# EAGLE design apm2_shield_GPS+MAG+SDF_v141 (EAGLE 5.11)
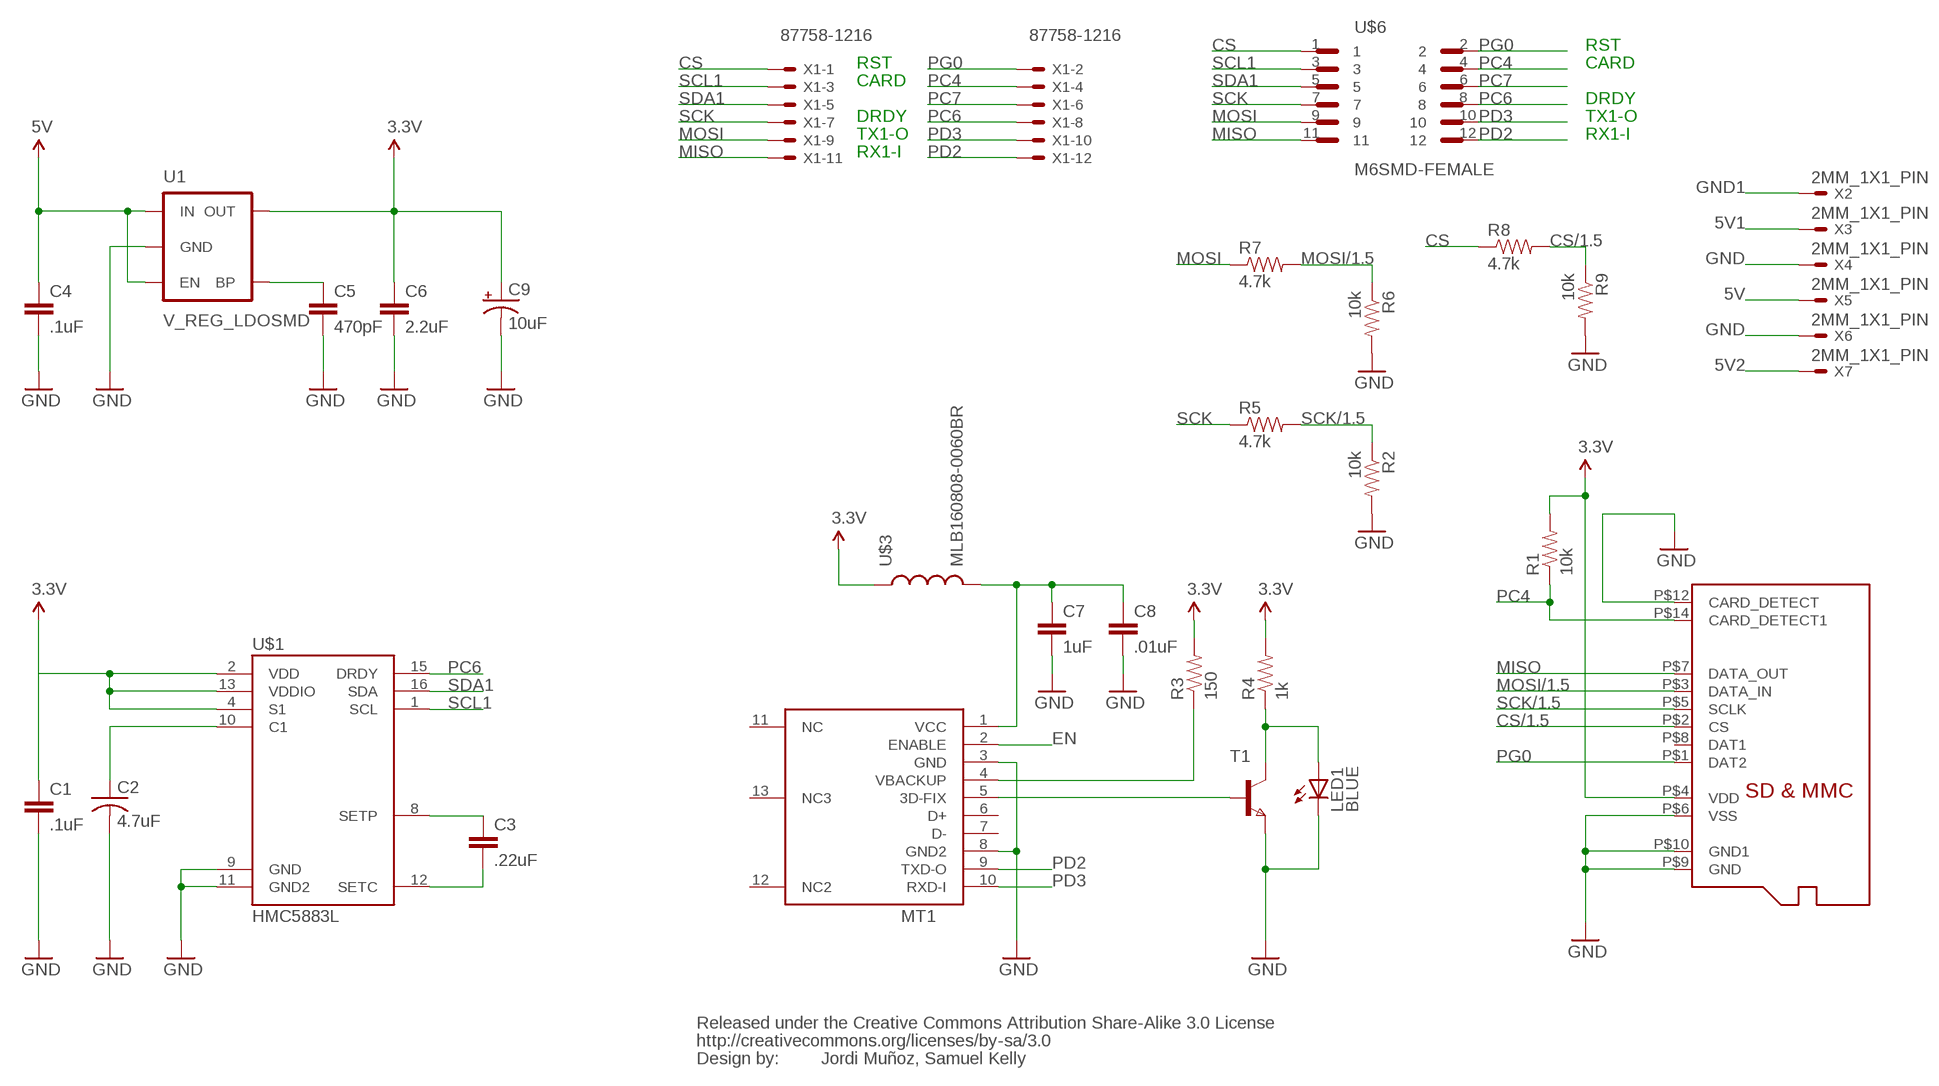
[diagram p0: schematic, sheet 1]

## Parts
C1  .1uF  CAP0402-CAP  [0402-CAP]
C2  4.7uF  C-USC1206  [C1206]
C3  .22uF  CAP0402-CAP  [0402-CAP]
C4  .1uF  CAP0402-CAP  [0402-CAP]
C5  470pF  CAP0402-CAP  [0402-CAP]
C6  2.2uF  CAP0402-CAP  [0402-CAP]
C7  1uF  CAP0402-CAP  [0402-CAP]
C8  .01uF  CAP0402-CAP  [0402-CAP]
C9  10uF  CAP_POL1206  [EIA3216]
LED1  BLUE  LED0603  [LED-0603]
MT1  MEDIATEK_MT3329_ANT_REV  [MEDIATEK_MT3329_ANT_REV]
R1  10k  RESISTOR0402-RES  [0402-RES]
R2  10k  RESISTOR0402-RES  [0402-RES]
R3  150  RESISTOR0402-RES  [0402-RES]
R4  1k  RESISTOR0402-RES  [0402-RES]
R5  4.7k  RESISTOR0402-RES  [0402-RES]
R6  10k  RESISTOR0402-RES  [0402-RES]
R7  4.7k  RESISTOR0402-RES  [0402-RES]
R8  4.7k  RESISTOR0402-RES  [0402-RES]
R9  10k  RESISTOR0402-RES  [0402-RES]
T1  NPNSOT323  [SOT323]
U1  V_REG_LDOSMD  [SOT23-5]
U$1  HMC5883L  [LPCC16]
U$3  MLB160808-0060BR  INDUCTOR0402  [C0402]
U$4  CREATIVE_COMMONS  [CREATIVE_COMMONS]
U$5  MICROSD'NON-PUSH'  [MICROSD_AMPHENOL]
U$6  M6SMD-FEMALE  [M6-2X6-2MM]
X1  87758-1216  [87758-1216]
X2  2MM_1X1_PIN  [2MM_1X1_PIN]
X3  2MM_1X1_PIN  [2MM_1X1_PIN]
X4  2MM_1X1_PIN  [2MM_1X1_PIN]
X5  2MM_1X1_PIN  [2MM_1X1_PIN]
X6  2MM_1X1_PIN  [2MM_1X1_PIN]
X7  2MM_1X1_PIN  [2MM_1X1_PIN]

## Nets
3.3V: C1.1 C6.1 C9.A(+) R1.2 R3.2 R4.2 U1.5(OUT) U$1.2(VDD) U$1.4(S1) U$1.13(VDDIO) U$3.1 U$5.P$4(VDD)
5V: C4.1 U1.1(IN) U1.3(EN) X5.P$1(S)
5V1: X3.P$1(S)
5V2: X7.P$1(S)
CS: R8.1 U$6.1 X1.1
CS/1.5: R8.2 R9.1 U$5.P$2(CS)
EN: MT1.2(ENABLE)
GND: C1.2 C2.2 C4.2 C5.2 C6.2 C7.2 C8.2 C9.C(-) LED1.C MT1.3(GND) MT1.8(GND2) R2.2 R6.2 R9.2 T1.3(E) U1.2(GND) U$1.9(GND) U$1.11(GND2) U$5.P$6(VSS) U$5.P$9(GND) U$5.P$10(GND1) U$5.P$12(CARD_DETECT) X4.P$1(S) X6.P$1(S)
GND1: X2.P$1(S)
MISO: U$5.P$7(DATA_OUT) U$6.11 X1.11
MOSI: R7.1 U$6.9 X1.9
MOSI/1.5: R6.1 R7.2 U$5.P$3(DATA_IN)
N$1: C2.1 U$1.10(C1)
N$2: C3.1 U$1.8(SETP)
N$3: C3.2 U$1.12(SETC)
N$4: C7.1 C8.1 MT1.1(VCC) U$3.2
N$5: C5.1 U1.4(BP)
N$6: MT1.4(VBACKUP) R3.1
N$7: LED1.A R4.1 T1.1(C)
N$8: MT1.5(3D-FIX) T1.2(B)
PC4: R1.1 U$5.P$14(CARD_DETECT1) U$6.4 X1.4
PC6: U$1.15(DRDY) U$6.8 X1.8
PC7: U$6.6 X1.6
PD2: MT1.9(TXD-O) U$6.12 X1.12
PD3: MT1.10(RXD-I) U$6.10 X1.10
PG0: U$5.P$1(DAT2) U$6.2 X1.2
SCK: R5.1 U$6.7 X1.7
SCK/1.5: R2.1 R5.2 U$5.P$5(SCLK)
SCL1: U$1.1(SCL) U$6.3 X1.3
SDA1: U$1.16(SDA) U$6.5 X1.5
Unconnected: MT1.6(D+) MT1.7(D-) MT1.11(NC) MT1.12(NC2) MT1.13(NC3) U$5.P$8(DAT1)

## Notes on the sheet
- RST
- RST | CARD
- CARD
- DRDY
- DRDY | TX1-O
- TX1-O | RX1-I
- RX1-I
- Jordi Muñoz, Samuel Kelly

## Library data of the parts
C1 C3-C8 = SparkFun:CAP: Capacitor Standard 0603 ceramic capacitor, and 0.1" leaded capacitor.
C2 = rcl:C-US: CAPACITOR, American symbol
C9 = SparkFun:CAP_POL: Capacitor Polarized These are standard SMD and PTH capacitors. Normally 10uF, 47uF, and 100uF in electrolytic and tantalum varieties. Always verify the external diameter of the through hole cap, it varies with capacity, voltage, and manufacturer. The EIA devices should be standard.
LED1 = SparkFun:LED: LEDs Standard schematic elements and footprints for 5mm, 3mm, 1206, and 0603 sized LEDs. 5mm - Spark Fun Electronics SKU : COM-00529 (and others)
MT1 = 3DRobotics:MEDIATEK_MT3329_ANT_REV: Based on MediaTek Single Chip Architecture. Dimension?16mm x 16mm x 6mm. L1 Frequency, C/A code, 66 channels. High Sensitivity?Up to -165dBm tracking, superior urban performances.
R1-R9 = SparkFun:RESISTOR: Resistor Basic schematic elements and footprints for 0603, 1206, and PTH 1/10th watt (small) resistors.
T1 = 3DRobotics:NPNSOT323: NPN TRANSISTOR; DATASHEET: http://www.nxp.com/documents/data_sheet/PDTC143E_SERIES.pdf; LINK: http://www.mouser.com/Search/ProductDetail.aspx?qs=LOCUfHb8d9uiSUZNrng0PQ%3D%3D; MFGPN: PDTC143EU,115
U1 = SparkFun:V_REG_LDO: Voltage Regulator LDO Standard 150mA LDO voltage regulator in SOT-23 layout. Micrel part MIC5205. BP (by-pass) pin is used to lower output noise with 470pF cap.
U$1 = 3DRobotics:HMC5883L: Honeywell HMC5883L 3-axis digital compass IC Successor to the HMC5843.; DATASHEET: http://www.dsscircuits.com/images/datasheets/HMC5883L.pdf; LINK: http://parts.digikey.com/1/parts/2057013-ic-compass-3-axis-i2c-16lcc-smd-hmc5883l-tr.html; MFGPN: HMC5883L-TR
U$3 = SparkFun:INDUCTOR: Inductors Basic Inductor/Choke - 0603 and 1206. Footprints are not proven and vary greatly between part numbers.
U$4 = SparkFun:CREATIVE_COMMONS
U$5 = 3DRobotics:MICROSD: Micro-SD / Transflash card holder with SPI pinout For the 3M # 2908-05WB-MG and/or 4UCON #19656 push-push type
U$6 = 3DRobotics:M6
X1 = con-molex:87758-1216: 12 Pin - 2mm Dual Row Single Wafer, Vertical T/H HDR Source: http://www.molex.com/pdm_docs/sd/877580616_sd.pdf; MPN: 87758-1216; OC_FARNELL: unknown; OC_NEWARK: 25M5671
X2-X7 = 3DRobotics:2MM_1X1_PIN: 2 Pin - 2mm Dual Row Single Wafer, Vertical T/H HDR Source: http://www.molex.com/pdm_docs/sd/877580616_sd.pdf

## Board
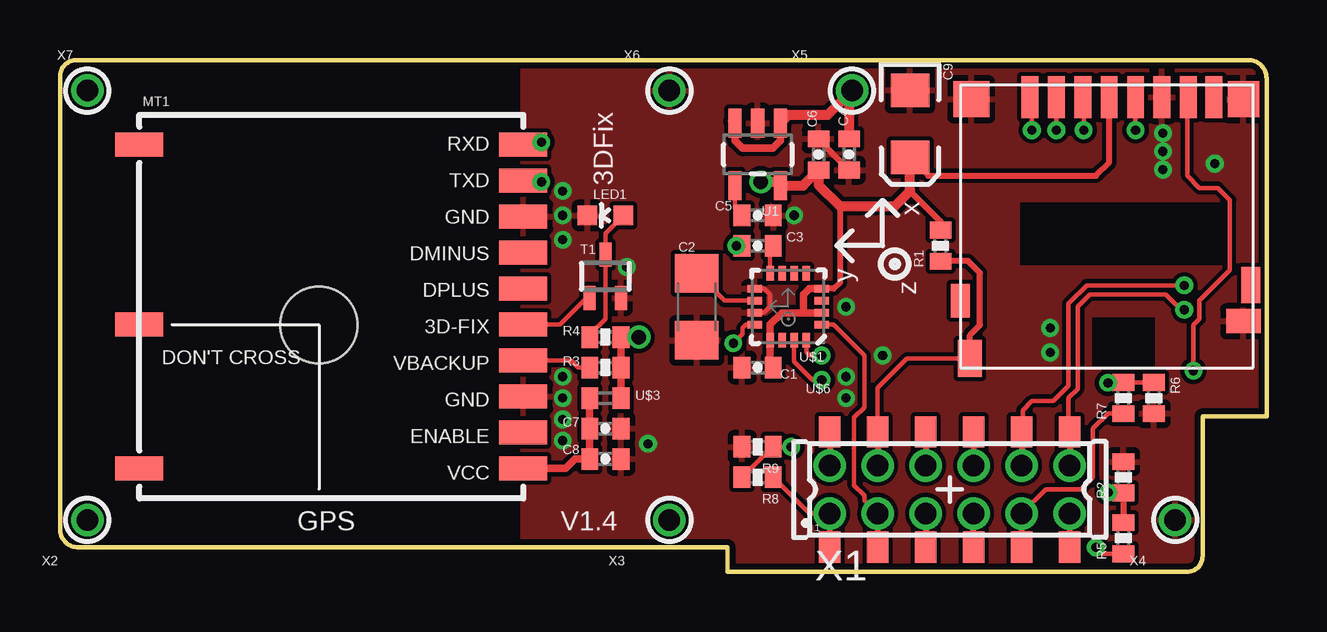
[diagram p1: board, top side]
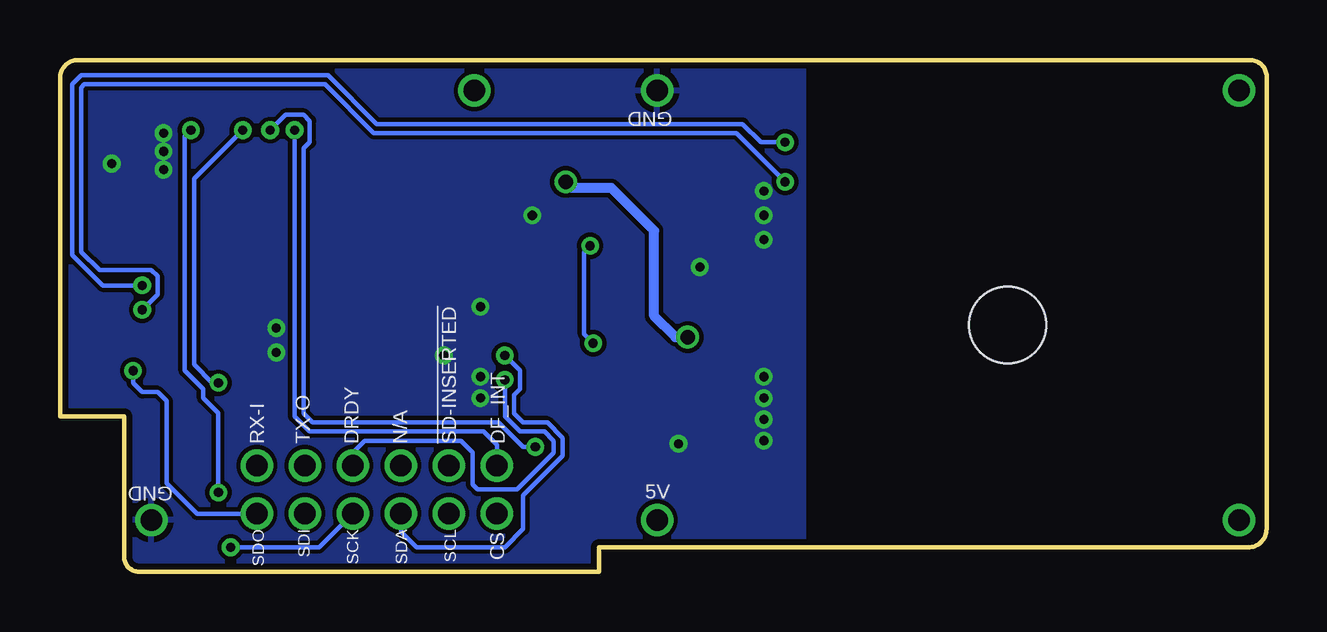
[diagram p2: board, bottom side, seen from below]

Size 50.29 x 21.34 mm. Coordinates in mm from the lower left corner, seen from the top.
Outline: 47.62,0.64 arc-90 46.99,0 27.81,0 27.81,1.02 0.76,1.02 arc-90 0,1.78 0,20.7 arc-90 0.76,21.34 49.53,21.34 arc-90 50.29,20.57 50.29,6.48 47.62,6.48 47.62,0.64
Copper layers (1*2+15*16): Top 0.035mm / dielectric 1.5mm / Route2 0.035mm / dielectric 0.15mm / Route15 0.035mm / dielectric 0.2mm / Bottom 0.035mm
Design rules "3DRobotics_4layers": minimum track width 7mil, minimum drill 15mil, track to track 7mil, track to pad 7mil, pad to pad 7mil, via to via 7mil, smd to smd 0mil, copper to edge 10mil, drill to drill 8mil, minimum pad ring 7mil, minimum via ring 7mil, stop-mask expansion 4mil, vias tented up to drill 25mil, thermal gap 10mil
Holes 3.2 mm at 10.79,10.29

### Footprints (pad centres in the part's own frame; a part is rotated, then mirrored left to right if it is on the bottom)
0402-CAP = smd 0.7 x 0.9: 1 -0.65,0; 2 0.65,0
C1206 = smd 1.6 x 1.8: 1 -1.4,0; 2 1.4,0
EIA3216 = smd 1.4 x 1.6: A 1.4,0; C -1.4,0
LED-0603 = smd 0.8 x 0.8: A 0,-0.75; C 0,0.75
MEDIATEK_MT3329_ANT_REV = smd 2 x 1: 1 -8,6.75; 2 -8,5.25; 3 -8,3.75; 4 -8,2.25; 5 -8,0.75; 6 -8,-0.75; 7 -8,-2.25; 8 -8,-3.75; 9 -8,-5.25; 10 -8,-6.75; 11 8,6.75; 12 8,-6.75; 13 8,0.75
0402-RES = smd 0.7 x 0.9: 1 -0.65,0; 2 0.65,0
SOT323 = smd 0.5 x 1: 1 0,0.9; 2 -0.65,-0.9; 3 0.65,-0.9
SOT23-5 = smd 0.55 x 1.2: 1 -0.95,-1.3; 2 0,-1.3; 3 0.95,-1.3; 4 0.95,1.3; 5 -0.95,1.3
LPCC16 = smd 0.6 x 0.3: 1 -1.4,0.75; 2 -1.4,0.25; 3 -1.4,-0.25; 4 -1.4,-0.75; 9 1.4,-0.75; 10 1.4,-0.25; 11 1.4,0.25; 12 1.4,0.75 | smd 0.3 x 0.6: 5 -0.75,-1.4; 6 -0.25,-1.4; 7 0.25,-1.4; 8 0.75,-1.4; 13 0.75,1.4; 14 0.25,1.4; 15 -0.25,1.4; 16 -0.75,1.4
C0402 = smd 0.7 x 0.9: 1 -0.65,0; 2 0.65,0
MICROSD_AMPHENOL = smd 0.7 x 1.75: P$1 7.7,-1; P$2 6.6,-1; P$3 5.5,-1; P$4 4.4,-1; P$5 3.3,-1; P$6 2.2,-1; P$7 1.1,-1; P$8 0.04,-1 | smd 1.5 x 1.5: P$9 10.15,-0.9 | smd 1.3 x 1.5: P$10 -1.2,-0.9 | smd 0.8 x 1.5: P$11 -1.5,6.85 | smd 1.45 x 1: P$12 -1.2,8.35 | smd 0.8 x 1.4: P$13 10.6,7.5 | smd 1 x 1.55: P$14 10.2,9.9
M6-2X6-2MM = smd 0.89 x 1.3: 1 -5,-2.4; 2 -5,2.4; 3 -3,-2.4; 4 -3,2.4; 5 -1,-2.4; 6 -1,2.4; 7 1,-2.4; 8 1,2.4; 9 3,-2.4; 10 3,2.4; 11 5,-2.4; 12 5,2.4
87758-1216 = drill 0.9 pad 1.27 round: 1 -5,-1; 2 -5,1; 3 -3,-1; 4 -3,1; 5 -1,-1; 6 -1,1; 7 1,-1; 8 1,1; 9 3,-1; 10 3,1; 11 5,-1; 12 5,1
2MM_1X1_PIN = drill 0.9 pad 1.27 round: P$1 0,0

### Placement (x,y rotation side)
C1  29.08,8.51 180 top
C2  26.54,11.05 270 top
C3  29.08,13.59 180 top
C4  32.89,17.4 270 top
C5  29.08,14.86 0 top
C6  31.62,17.4 90 top
C7  22.73,5.97 0 top
C8  22.73,4.7 0 top
C9  35.43,18.67 270 top
LED1  22.73,14.86 90 top
MT1  11.3,11.05 180 top
R1  36.7,13.59 90 top
R2  44.32,3.94 90 top
R3  22.73,8.51 0 top
R4  22.73,9.78 0 top
R5  44.32,1.4 90 top
R6  45.59,7.24 270 top
R7  44.32,7.24 90 top
R8  29.08,3.94 180 top
R9  29.08,5.21 180 top
T1  22.73,12.32 0 top
U1  29.08,17.4 180 top
U$1  30.35,11.05 180 top
U$3  22.73,7.24 180 top
U$4  19.69,-10.54 0 top  (outside the outline)
U$5  48.13,18.8 180 top
U$6  37.08,3.43 0 top
X1  37.08,3.43 0 top
X2  1.14,2.16 0 top
X3  25.4,2.16 0 top
X4  46.48,2.16 0 top
X5  33.02,20.07 0 top
X6  25.4,20.07 0 top
X7  1.14,20.07 0 top

### Tracks (layer width: path | path; a pad name or v marks a point on that pad's centre or on a via)
3.3V  (via drill 0.6)
  Top 0.178: 29.72,8.51 C1.1
  Top 0.254: U$5.P$4 43.73,17.06 43.18,16.51 36.19,16.51 C9.A | U$1.4 32.25,11.8 32.51,12.06 32.51,15.24 | R1.2 36.7,14.6 35.43,15.88
  Top 0.305: U$3.1 R3.2 R4.2 | 30.99,10.79 30.1,10.79 29.6,10.3 U$1.13 29.6,8.62 29.72,8.51 | 30.99,10.79 U$1.2 | U$1.4 31.23,11.8 30.99,11.56 30.99,10.79 | 31.62,16.76 31.61,16.76 C6.1
  Top 0.406: C9.A 35.43,15.88 34.8,15.24 32.51,15.24 31.62,16.13 C6.1 30.97,16.1 U1.5 29.88,16.26 v29.21,16.26 | R4.2 v24.13,9.78
  Bottom 0.406: v24.13,9.78 24.64,9.78 25.53,10.67 25.53,14.22 27.3,16 28.96,16 v29.21,16.26
5V
  Top 0.305: U1.3 28.13,17.97 28.45,17.65 29.72,17.65 30.03,17.97 U1.1
  Top 0.406: U1.3 28.04,18.8 | 32.89,18.41 C4.1 32.89,19.94 X5.P$1 32,19.05 30.38,19.05 U1.1
CS
  Top 0.178: X1.1 31.24,2.43 R8.1
  Top 0.254: U$6.1 X1.1
CS/1.5  (via drill 0.38)
  Top 0.178: U$5.P$2 v41.53,18.42 v41.53,18.41 | v30.48,5.21 R9.1 29.7,5.21 R8.2
  Bottom 0.178: v41.53,18.41 40.89,19.05 40.13,19.05 39.88,18.8 39.88,17.91 40.13,17.65 40.13,6.6 39.75,6.22 32,6.22 30.99,5.21 v30.48,5.21
GND  (via drill 0.38)
  Top 0.178: U$1.9 29.35,11.8 29.59,11.56 29.59,11.05 29.34,10.8 U$1.11
  Top 0.203: C4.2 32.89,16.78
  Top 0.254: C6.2 31.62,18.02 C4.2
  other vias: 20.96,7.24 20.96,14.86 20.96,13.84 20.96,15.88 48.13,17.02 45.97,16.76 41.27,10.16 24.51,5.33 20.96,8.13 20.96,6.35 30.61,14.86 23.62,12.7 41.27,9.14 20.96,5.46 32.77,7.24 32.77,8.13 45.97,18.29 45.97,17.53 32.77,11.05 34.29,9.02
  pour Bottom: 19.3,0.89 19.3,23.75 50.67,23.75 50.67,-2.92 27.81,-2.92 27.81,0.89
  pour Top: 19.3,0.89 19.3,23.75 50.67,23.75 50.67,-2.92 27.81,-2.92 27.81,0.89
MISO  (via drill 0.38)
  Top 0.178: U$5.P$7 46.99,19.75 46.99,16.51 47.5,16 48.26,16 48.77,15.49 48.77,12.57 47.5,11.3 47.5,10.54 47.24,10.29 v47.24,8.38
  Top 0.254: U$6.11 X1.11
  Bottom 0.178: v47.24,8.38 47.24,7.87 46.86,7.49 46.23,7.49 45.85,7.11 45.85,3.68 44.58,2.41 42.1,2.41 X1.11
MOSI
  Top 0.178: X1.9 41.08,3.43 42.54,3.43 43.05,3.94 43.05,5.97 43.69,6.6 44.31,6.6 R7.1
  Top 0.254: U$6.9 X1.9
MOSI/1.5  (via drill 0.38)
  Top 0.178: v42.67,18.41 42.67,19.76 U$5.P$3 | R6.1 R7.2 43.7,7.89 v43.69,7.87
  Bottom 0.178: v42.67,18.41 44.7,16.38 44.7,8.64 43.94,7.87 v43.69,7.87
N$1
  Top 0.178: U$1.10 27.69,11.3 C2.1
N$2
  Top 0.178: C3.1 29.73,13.48 29.59,13.33 29.59,12.46 U$1.8
N$3  (via drill 0.38)
  Top 0.178: v28.19,13.59 C3.2 | U$1.12 28.59,10.3 28.45,10.16 28.45,9.91 v28.07,9.52
  Bottom 0.178: v28.19,13.59 28.45,13.33 28.45,9.91 v28.07,9.52
N$4
  Top 0.305: U$3.2 C7.1 C8.1 21.46,4.7 21.06,4.3 MT1.1
N$5
  Top 0.178: U1.4 28.13,15.16 C5.1
N$6
  Top 0.178: MT1.4 21.3,8.8 21.59,8.51 R3.1
N$7
  Top 0.178: R4.1 22.08,9.89 22.73,10.54 T1.1 22.73,14.11 LED1.A
N$8
  Top 0.178: MT1.5 20.84,10.3 21.97,11.43 22.07,11.43 T1.2
PC4
  Top 0.178: U$5.P$14 35.31,8.89 34.08,7.67 U$6.4
  Top 0.254: U$5.P$14 37.93,9.87 38.35,10.29 38.35,12.45 37.85,12.95 36.72,12.95 R1.1 | U$6.4 X1.4
PC6  (via drill 0.38)
  Top 0.178: U$1.15 30.6,8.77 31.37,8 v31.75,8
  Top 0.254: U$6.8 X1.8
  Bottom 0.178: X1.8 38.08,4.97 37.59,5.46 33.58,5.46 33.1,4.98 33.1,3.63 32.89,3.43 31.24,3.43 29.72,4.95 29.72,5.46 30.1,5.84 31.12,5.84 31.75,6.48 v31.75,8
PC7
  Top 0.254: U$6.6 X1.6
PD2  (via drill 0.38)
  Top 0.178: v20.07,16.26 19.35,16.26 MT1.9 | v46.86,10.92 46.74,10.92 46.1,11.56 42.93,11.56 42.42,11.05 42.42,7.62 42.04,7.24 42.04,5.88 U$6.12
  Top 0.254: U$6.12 X1.12
  Bottom 0.178: v20.07,16.26 22.1,18.29 37.21,18.29 39.24,20.32 49.28,20.32 49.4,20.19 49.4,13.33 48.64,12.57 46.48,12.57 46.23,12.32 46.23,11.56 v46.86,10.92
PD3  (via drill 0.38)
  Top 0.178: v20.07,17.91 19.41,17.91 MT1.10 | v46.86,11.94 42.8,11.94 42.04,11.18 42.04,7.75 41.4,7.11 40.51,7.11 40.13,6.73 40.13,5.88 U$6.10
  Top 0.254: U$6.10 X1.10
  Bottom 0.178: v20.07,17.91 21.08,17.91 21.84,18.67 37.08,18.67 39.12,20.7 49.4,20.7 49.78,20.32 49.78,13.21 48.51,11.94 v46.86,11.94
PG0  (via drill 0.38)
  Top 0.178: v40.51,18.41 40.51,19.72 U$5.P$1
  Top 0.254: U$6.2 X1.2
  Bottom 0.178: v40.51,18.41 40.51,6.48 39.88,5.84 32.64,5.84 32.08,5.29 X1.2
SCK  (via drill 0.38)
  Top 0.178: R5.1 43.45,0.75 v43.18,1.02
  Top 0.254: X1.7 U$6.7
  Bottom 0.178: v43.18,1.02 39.5,1.02 X1.7
SCK/1.5  (via drill 0.38)
  Top 0.178: v44.83,18.41 U$5.P$5 | v43.69,3.3 44.31,3.3 R2.1
  Top 0.254: R2.1 R5.2
  Bottom 0.178: v44.83,18.41 45.09,18.16 45.09,8.38 44.32,7.62 44.32,7.24 43.7,6.62 43.7,3.32 v43.69,3.3
SCL1
  Top 0.178: U$1.1 32.25,10.3 33.53,9.02 33.53,6.86 33.1,6.43 33.1,3.61 33.53,3.17 33.53,2.98 X1.3
  Top 0.254: U$6.3 X1.3
SDA1  (via drill 0.38)
  Top 0.178: U$6.5 36.07,1.01 | U$1.16 31.11,9.15 31.24,9.02 v31.75,9.02
  Top 0.254: U$6.5 X1.5
  Bottom 0.178: X1.5 36.08,1.67 35.43,1.02 31.75,1.02 30.99,1.78 30.99,3.17 29.34,4.83 29.34,5.59 29.97,6.22 30.99,6.22 31.37,6.6 31.37,7.37 31.12,7.62 31.12,8.38 v31.75,9.02

### Text on the board
tPlace: 3DFix | x | y | z | GPS | V1.4
bPlace: GND | DF_INT | !SD-INSERTED | N/A | DRDY | TX-O | RX-I | GND | 5V | CS | SCL | SDA | SCK | SDI | SDO
Document: DataFlash inserted | Jordi Muñoz, Samuel Kelly